# Altium schematic sheet LAN8830_PINOUT.SchDoc
size C; SheetNumber: 4; SheetTotal: 7
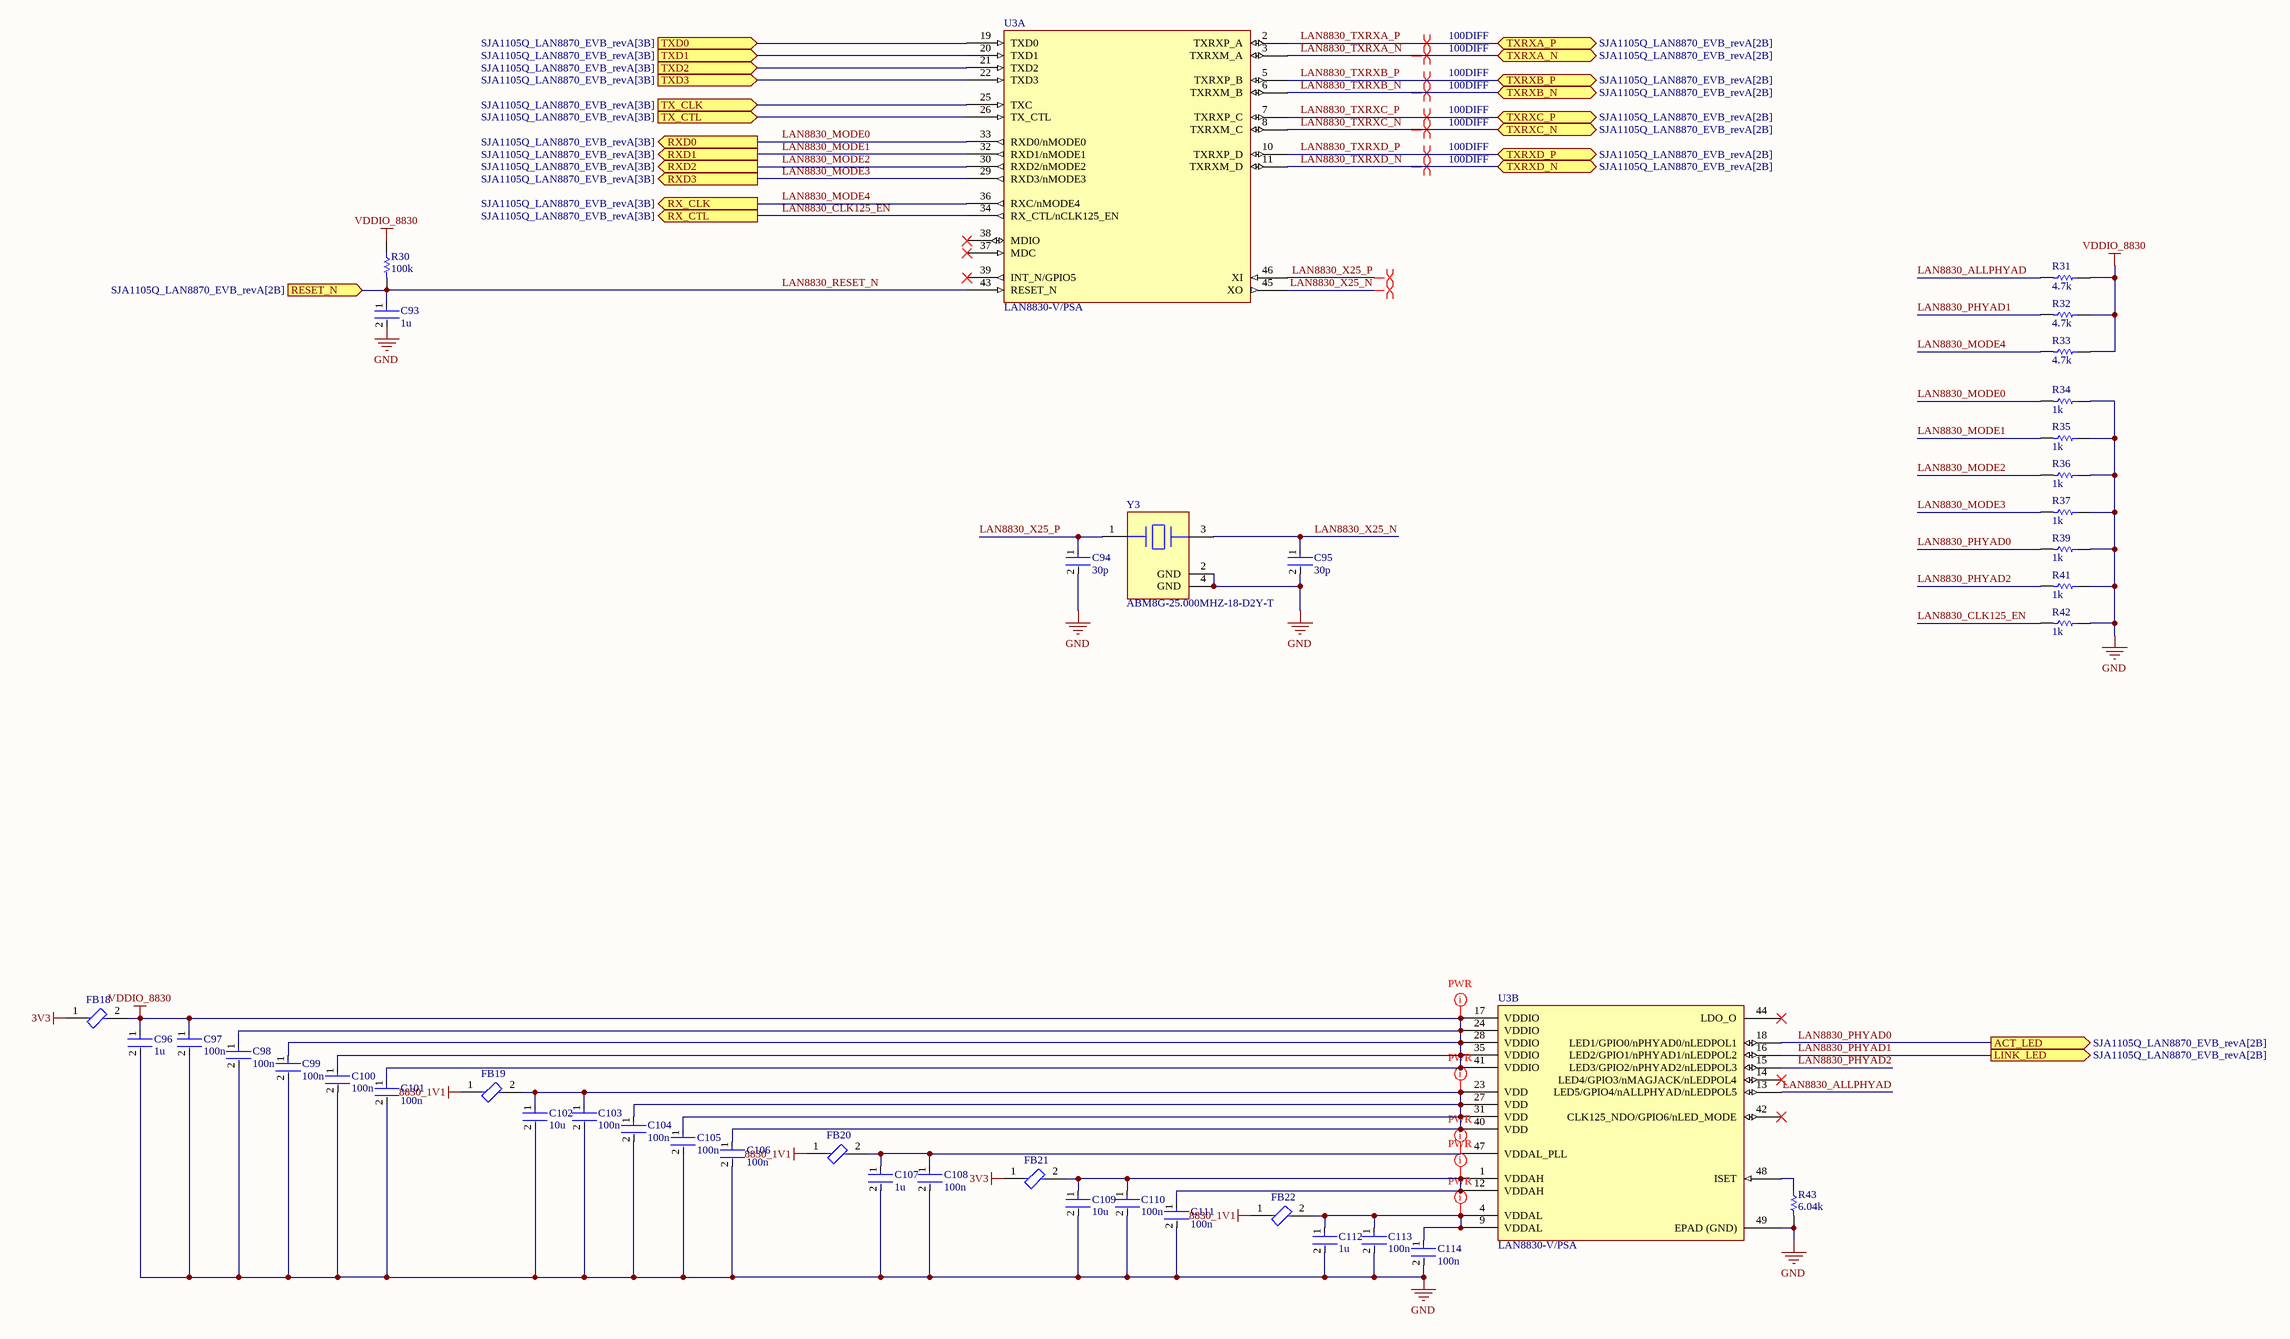
[diagram p0: LAN8830_PINOUT.SchDoc]

## Parts
C93  1u  [FP-0402-L_1_0_0_05-W_0_5-IPC_A]
C94  30p  [FP-0402-L_1_0_0_05-W_0_5-IPC_A]
C95  30p  [FP-0402-L_1_0_0_05-W_0_5-IPC_A]
C96  1u  [FP-0402-L_1_0_0_05-W_0_5-IPC_A]
C97  100n  [FP-0402-L_1_0_0_05-W_0_5-IPC_A]
C98  100n  [FP-0402-L_1_0_0_05-W_0_5-IPC_A]
C99  100n  [FP-0402-L_1_0_0_05-W_0_5-IPC_A]
C100  100n  [FP-0402-L_1_0_0_05-W_0_5-IPC_A]
C101  100n  [FP-0402-L_1_0_0_05-W_0_5-IPC_A]
C102  10u  [FP-0402-L_1_0_0_05-W_0_5-IPC_A]
C103  100n  [FP-0402-L_1_0_0_05-W_0_5-IPC_A]
C104  100n  [FP-0402-L_1_0_0_05-W_0_5-IPC_A]
C105  100n  [FP-0402-L_1_0_0_05-W_0_5-IPC_A]
C106  100n  [FP-0402-L_1_0_0_05-W_0_5-IPC_A]
C107  1u  [FP-0402-L_1_0_0_05-W_0_5-IPC_A]
C108  100n  [FP-0402-L_1_0_0_05-W_0_5-IPC_A]
C109  10u  [FP-0402-L_1_0_0_05-W_0_5-IPC_A]
C110  100n  [FP-0402-L_1_0_0_05-W_0_5-IPC_A]
C111  100n  [FP-0402-L_1_0_0_05-W_0_5-IPC_A]
C112  1u  [FP-0402-L_1_0_0_05-W_0_5-IPC_A]
C113  100n  [FP-0402-L_1_0_0_05-W_0_5-IPC_A]
C114  100n  [FP-0402-L_1_0_0_05-W_0_5-IPC_A]
FB18  BLM18KG331SH1D  [FP-BLM18-0_15-t0_8-IPC_B]  (value not drawn)
FB19  BLM18KG331SH1D  [FP-BLM18-0_15-t0_8-IPC_B]  (value not drawn)
FB20  BLM18KG331SH1D  [FP-BLM18-0_15-t0_8-IPC_B]  (value not drawn)
FB21  BLM18KG331SH1D  [FP-BLM18-0_15-t0_8-IPC_B]  (value not drawn)
FB22  BLM18KG331SH1D  [FP-BLM18-0_15-t0_8-IPC_B]  (value not drawn)
R30  100k  [R0603B]
R31  4.7k  [R0603B]
R32  4.7k  [R0603B]
R33  4.7k  [R0603B]
R34  1k  [R0603B]
R35  1k  [R0603B]
R36  1k  [R0603B]
R37  1k  [R0603B]
R39  1k  [R0603B]
R41  1k  [R0603B]
R42  1k  [R0603B]
R43  6.04k  [R0603B]
U3  LAN8830-V/PSA  [QFN50P700X700X100_HS-49N]  (parts A,B of 2)
Y3  ABM8G-25.000MHZ-18-D2Y-T  [FP-ABM8G-MFG]

## Ports
ACT_LED (out, see SJA1105Q_LAN8870_EVB_revA[2B]), LINK_LED (out, see SJA1105Q_LAN8870_EVB_revA[2B]), RESET_N (in, see SJA1105Q_LAN8870_EVB_revA[2B]), RX_CLK (out, see SJA1105Q_LAN8870_EVB_revA[3B]), RX_CTL (out, see SJA1105Q_LAN8870_EVB_revA[3B]), RXD0 (out, see SJA1105Q_LAN8870_EVB_revA[3B]), RXD1 (out, see SJA1105Q_LAN8870_EVB_revA[3B]), RXD2 (out, see SJA1105Q_LAN8870_EVB_revA[3B]), RXD3 (out, see SJA1105Q_LAN8870_EVB_revA[3B]), TX_CLK (in, see SJA1105Q_LAN8870_EVB_revA[3B]), TX_CTL (in, see SJA1105Q_LAN8870_EVB_revA[3B]), TXD0 (in, see SJA1105Q_LAN8870_EVB_revA[3B]), TXD1 (in, see SJA1105Q_LAN8870_EVB_revA[3B]), TXD2 (in, see SJA1105Q_LAN8870_EVB_revA[3B]), TXD3 (in, see SJA1105Q_LAN8870_EVB_revA[3B]), TXRXA_N (bidir, see SJA1105Q_LAN8870_EVB_revA[2B]), TXRXA_P (bidir, see SJA1105Q_LAN8870_EVB_revA[2B]), TXRXB_N (bidir, see SJA1105Q_LAN8870_EVB_revA[2B]), TXRXB_P (bidir, see SJA1105Q_LAN8870_EVB_revA[2B]), TXRXC_N (bidir, see SJA1105Q_LAN8870_EVB_revA[2B]), TXRXC_P (bidir, see SJA1105Q_LAN8870_EVB_revA[2B]), TXRXD_N (bidir, see SJA1105Q_LAN8870_EVB_revA[2B]), TXRXD_P (bidir, see SJA1105Q_LAN8870_EVB_revA[2B])

## Nets
3V3: FB18.1 FB21.1
8830_1V1: FB19.1 FB20.1 FB22.1
GND: C93.2 C94.2 C95.2 C96.2 C97.2 C98.2 C99.2 C100.2 C101.2 C102.2 C103.2 C104.2 C105.2 C106.2 C107.2 C108.2 C109.2 C110.2 C111.2 C112.2 C113.2 C114.2 R34.1 R35.1 R36.1 R37.1 R39.1 R41.1 R42.1 R43.2 U3.49(EPAD_(GND)) Y3.2(GND) Y3.4(GND)
VDDIO_8830: C96.1 C97.1 C98.1 C99.1 C100.1 C101.1 FB18.2 R30.1 R31.1 R32.1 R33.1 U3.17(VDDIO) U3.24(VDDIO) U3.28(VDDIO) U3.35(VDDIO) U3.41(VDDIO)
LAN8830_ALLPHYAD: R31.2 U3.13(LED5/GPIO4/nALLPHYAD/nLEDPOL5)
LAN8830_CLK125_EN: R42.2 U3.34(RX_CTL/nCLK125_EN) ; port RX_CTL
LAN8830_MODE0: R34.2 U3.33(RXD0/nMODE0) ; port RXD0
LAN8830_MODE1: R35.2 U3.32(RXD1/nMODE1) ; port RXD1
LAN8830_MODE2: R36.2 U3.30(RXD2/nMODE2) ; port RXD2
LAN8830_MODE3: R37.2 U3.29(RXD3/nMODE3) ; port RXD3
LAN8830_MODE4: R33.2 U3.36(RXC/nMODE4) ; port RX_CLK
LAN8830_PHYAD0: R39.2 U3.18(LED1/GPIO0/nPHYAD0/nLEDPOL1) ; port ACT_LED
LAN8830_PHYAD1: R32.2 U3.16(LED2/GPIO1/nPHYAD1/nLEDPOL2) ; port LINK_LED
LAN8830_PHYAD2: R41.2 U3.15(LED3/GPIO2/nPHYAD2/nLEDPOL3)
LAN8830_RESET_N: C93.1 R30.2 U3.43(RESET_N) ; port RESET_N
LAN8830_TXRXA_N: U3.3(TXRXM_A) ; port TXRXA_N
LAN8830_TXRXA_P: U3.2(TXRXP_A) ; port TXRXA_P
LAN8830_TXRXB_N: U3.6(TXRXM_B) ; port TXRXB_N
LAN8830_TXRXB_P: U3.5(TXRXP_B) ; port TXRXB_P
LAN8830_TXRXC_N: U3.8(TXRXM_C) ; port TXRXC_N
LAN8830_TXRXC_P: U3.7(TXRXP_C) ; port TXRXC_P
LAN8830_TXRXD_N: U3.11(TXRXM_D) ; port TXRXD_N
LAN8830_TXRXD_P: U3.10(TXRXP_D) ; port TXRXD_P
LAN8830_X25_N: C95.1 U3.45(XO) Y3.3
LAN8830_X25_P: C94.1 U3.46(XI) Y3.1
TX_CLK: U3.25(TXC) ; port TX_CLK
TX_CTL: U3.26(TX_CTL) ; port TX_CTL
TXD0: U3.19(TXD0) ; port TXD0
TXD1: U3.20(TXD1) ; port TXD1
TXD2: U3.21(TXD2) ; port TXD2
TXD3: U3.22(TXD3) ; port TXD3
NetC102_1: C102.1 C103.1 C104.1 C105.1 C106.1 FB19.2 U3.23(VDD) U3.27(VDD) U3.31(VDD) U3.40(VDD)
NetC107_1: C107.1 C108.1 FB20.2 U3.47(VDDAL_PLL)
NetC109_1: C109.1 C110.1 C111.1 FB21.2 U3.1(VDDAH) U3.12(VDDAH)
NetC112_1: C112.1 C113.1 C114.1 FB22.2 U3.4(VDDAL) U3.9(VDDAL)
NetR43_1: R43.1 U3.48(ISET)

Not connected (* = marked no-connect by the designer): U3 14(LED4/GPIO3/nMAGJACK/nLEDPOL4)* 37(MDC)* 38(MDIO)* 39(INT_N/GPIO5)* 42(CLK125_NDO/GPIO6/nLED_MODE)* 44(LDO_O)*

## Layout directives
differential pair; differential pair class 100DIFF: LAN8830_TXRXA_N, LAN8830_TXRXA_P, LAN8830_TXRXB_N, LAN8830_TXRXB_P, LAN8830_TXRXC_N, LAN8830_TXRXC_P, LAN8830_TXRXD_N, LAN8830_TXRXD_P
differential pair: LAN8830_X25_N, LAN8830_X25_P
net class PWR: NetC102_1, NetC107_1, NetC109_1, NetC112_1, VDDIO_8830

## Library data of the parts
C93-C114 = CMP-001-00058-1: LARGE PADS, 0402 CAP, CHANGE COMMENT TO MATCH REAL P/N; Capacitor Type: Ceramic; Min Operating Temperature: -55°C; Mounting Technology: Surface Mount; Pins: 2; Case/Package: 0402; RoHS Compliant: Yes; Max Operating Temperature: 85°C
FB18-FB22 = CMP-06046-002069-1: Chip Ferrite Bead, 0603, 330Ω @ 100MHz, 0.08Ω, 25%, 1.7A; Number of Lines: 1; DC Resistance (DCR): 80mR; Packaging: Tape and Reel; Case/Package: 0603; Height: 0.037inch; Case Code (Metric): 1608; Length: 0.063inch; Package Quantity: 4000; Max Operating Temperature: 125°C; Case Code (Imperial): 0603; RoHS Compliant: Yes; Width: 0.032inch; Mount: Surface Mount; Min Operating Temperature: -55°C; Ratings: AEC-Q200; Max Current Rating: 1.7A
R30-R37 R39 R41-R43 = CMP-009-00002-14: Resistor
  R30: Value: 100k
  R31-R33: Value: 4.7k
  R34-R37 R39 R41 R42: Value: 1k
  R43: Value: 6.04k
U3 = CMP-015-00022-5: LAN8830 Series RGMII Interface Gigabit Ethernet Transceiver - VQFN-48; Case/Package: VQFN; Pins: 48
Y3 = CMP-2000-05733-3: Crystal 25MHz ±20ppm (Tol) ±30ppm (Stability) 18pF FUND 60Ω 4-Pin SMD T/R; Series Resistance: 60R; Length: 3.2mm; Depth: 2.5mm; Packaging: Tape and Reel; Min Operating Temperature: -40°C; Operating Frequency: 25 MHz; Lead Free: Lead Free; Number of Pins: 4; Frequency Tolerance: 20ppm; Radiation Hardening: No; Max Operating Temperature: 85°C; Termination: SMD/SMT; Frequency Stability: 30ppm; Frequency: 25MHz; Series: ABM8G; Mount: Surface Mount; Package Quantity: 1000; Height: 0.039inch; Width: 0.098inch; Case/Package: CSMD; ESR (Equivalent Series Resistance): 60R; Load Capacitance: 18pF; Tolerance: 20ppm